# Altium schematic sheet epd.SchDoc
size A; SheetNumber: 3; SheetTotal: 3
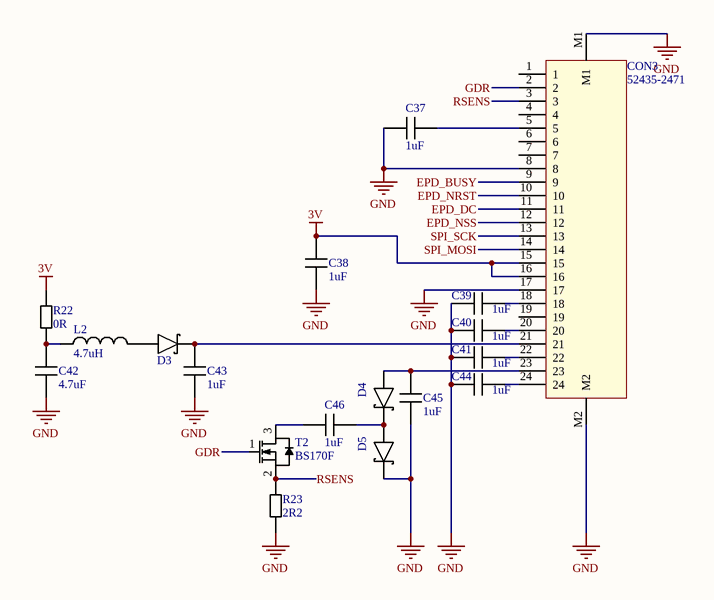
[diagram p0: epd.SchDoc]

## Parts
C37  value 1uF  [C0402]  (hidden comment: 1uF (0402) AEC-Q200 HT)
C38  value 1uF  [C0402]  (hidden comment: 1uF (0402) AEC-Q200 HT)
C39  value 1uF  [C0402]  (hidden comment: 1uF (0402) AEC-Q200 HT)
C40  value 1uF  [C0402]  (hidden comment: 1uF (0402) AEC-Q200 HT)
C41  value 1uF  [C0402]  (hidden comment: 1uF (0402) AEC-Q200 HT)
C42  value 4.7uF  [C0402]  (hidden comment: 4.7uF (0402) AEC-Q200)
C43  value 1uF  [C0402]  (hidden comment: 1uF (0402) AEC-Q200 HT)
C44  value 1uF  [C0402]  (hidden comment: 1uF (0402) AEC-Q200 HT)
C45  value 1uF  [C0402]  (hidden comment: 1uF (0402) AEC-Q200 HT)
C46  value 1uF  [C0402]  (hidden comment: 1uF (0402) AEC-Q200 HT)
CON3  52435-2471  [52435-2471]
D3  Schottky (0402) AEC-Q101  [SOD-882 (0402)]  (value not drawn)
D4  Schottky (0402) AEC-Q101  [SOD-882 (0402)]  (value not drawn)
D5  Schottky (0402) AEC-Q101  [SOD-882 (0402)]  (value not drawn)
L2  value 4.7uH  [S0603]  (hidden comment: 4.7uH (0603))
R22  value 0R  [R0402]  (hidden comment: 0R (0402) AEC-Q200)
R23  value 2R2  [R0402]  (hidden comment: 2R2 (0402))
T2  BS170F  [SOT-23-3]

## Nets
3V: C38.1 CON3.15 CON3.16 R22.2
GND: C37.1 C38.2 C39.2 C40.2 C41.2 C42.2 C43.2 C44.2 C45.2 CON3.8 CON3.17 CON3.M1 CON3.M2 D5.K R23.1
EPD_BUSY: CON3.9
EPD_DC: CON3.11
EPD_NRST: CON3.10
EPD_NSS: CON3.12
GDR: CON3.2 T2.1(G)
RSENS: CON3.3 R23.2 T2.2(S)
SPI_MOSI: CON3.14
SPI_SCK: CON3.13
NetC37_2: C37.2 CON3.5
NetC39_1: C39.1 CON3.18
NetC40_1: C40.1 CON3.20
NetC41_1: C41.1 CON3.22
NetC42_1: C42.1 L2.1 R22.1
NetC43_1: C43.1 CON3.21 D3.K
NetC44_1: C44.1 CON3.24
NetC45_1: C45.1 CON3.23 D4.A
NetC46_1: C46.1 T2.3(D)
NetC46_2: C46.2 D4.K D5.A
NetD3_A: D3.A L2.2

Not connected (* = marked no-connect by the designer): CON3 1 4 6 7 19

## Library data of the parts
C37-C41 C43-C46 = 1uF (0402) AEC-Q200 HT: X6S 10% 0402 25V AEC-Q200; Fabricant: Murata; Référence: GRT155C81E105KE13D
C42 = 4.7uF (0402) AEC-Q200: X7T 0402 10% 6.3V AEC-Q200; Référence: KAM05CT70J475KH; Fabricant: KYOCERA AVX
CON3 = 52435-2471: Connecteur FFC/FPC, Right-Angle, Surface Mount, ZIF, Top Contact / Style, 24 Circuits; Fabricant: MOLEX; Référence: 52435-2471; Value: 52435-2471
D3-D5 = Schottky (0402) AEC-Q101: 0402 40V 0.2A AEC-Q101; Fabricant: NEXPERIA; Référence: PMEG4002EL,315; Value: Schottky
L2 = 4.7uH (0603): 20% 0603 blindé; Fabricant: COILCRAFT; Référence: PFL1609-472MEU
R22 = 0R (0402) AEC-Q200: 0.1% 0402 0.1W AEC-Q200; Référence: ERJ-U020R00X; Fabricant: PANASONIC
R23 = 2R2 (0402): 1% 0402 0.1W 100ppm; Fabricant: YAGEO; Référence: AC0402FR-072R2L
T2 = BS170F: N-MOS || SOT23 60V 150mA; Fabricant: Diodes Inc.; Référence: BS170F; Supplier: Farnell; RefSupplier: 9526005; Value: BS170F